# Altium schematic sheet 04_GAP_GPIO.SchDoc: SENSEI Base Board - GAP GPIO
size A3; DrawnBy: Sebastian Frey; Organization: Integrated Systems Laboratory; DocumentNumber: 5; Revision: v1.0; SheetNumber: 5; SheetTotal: 12
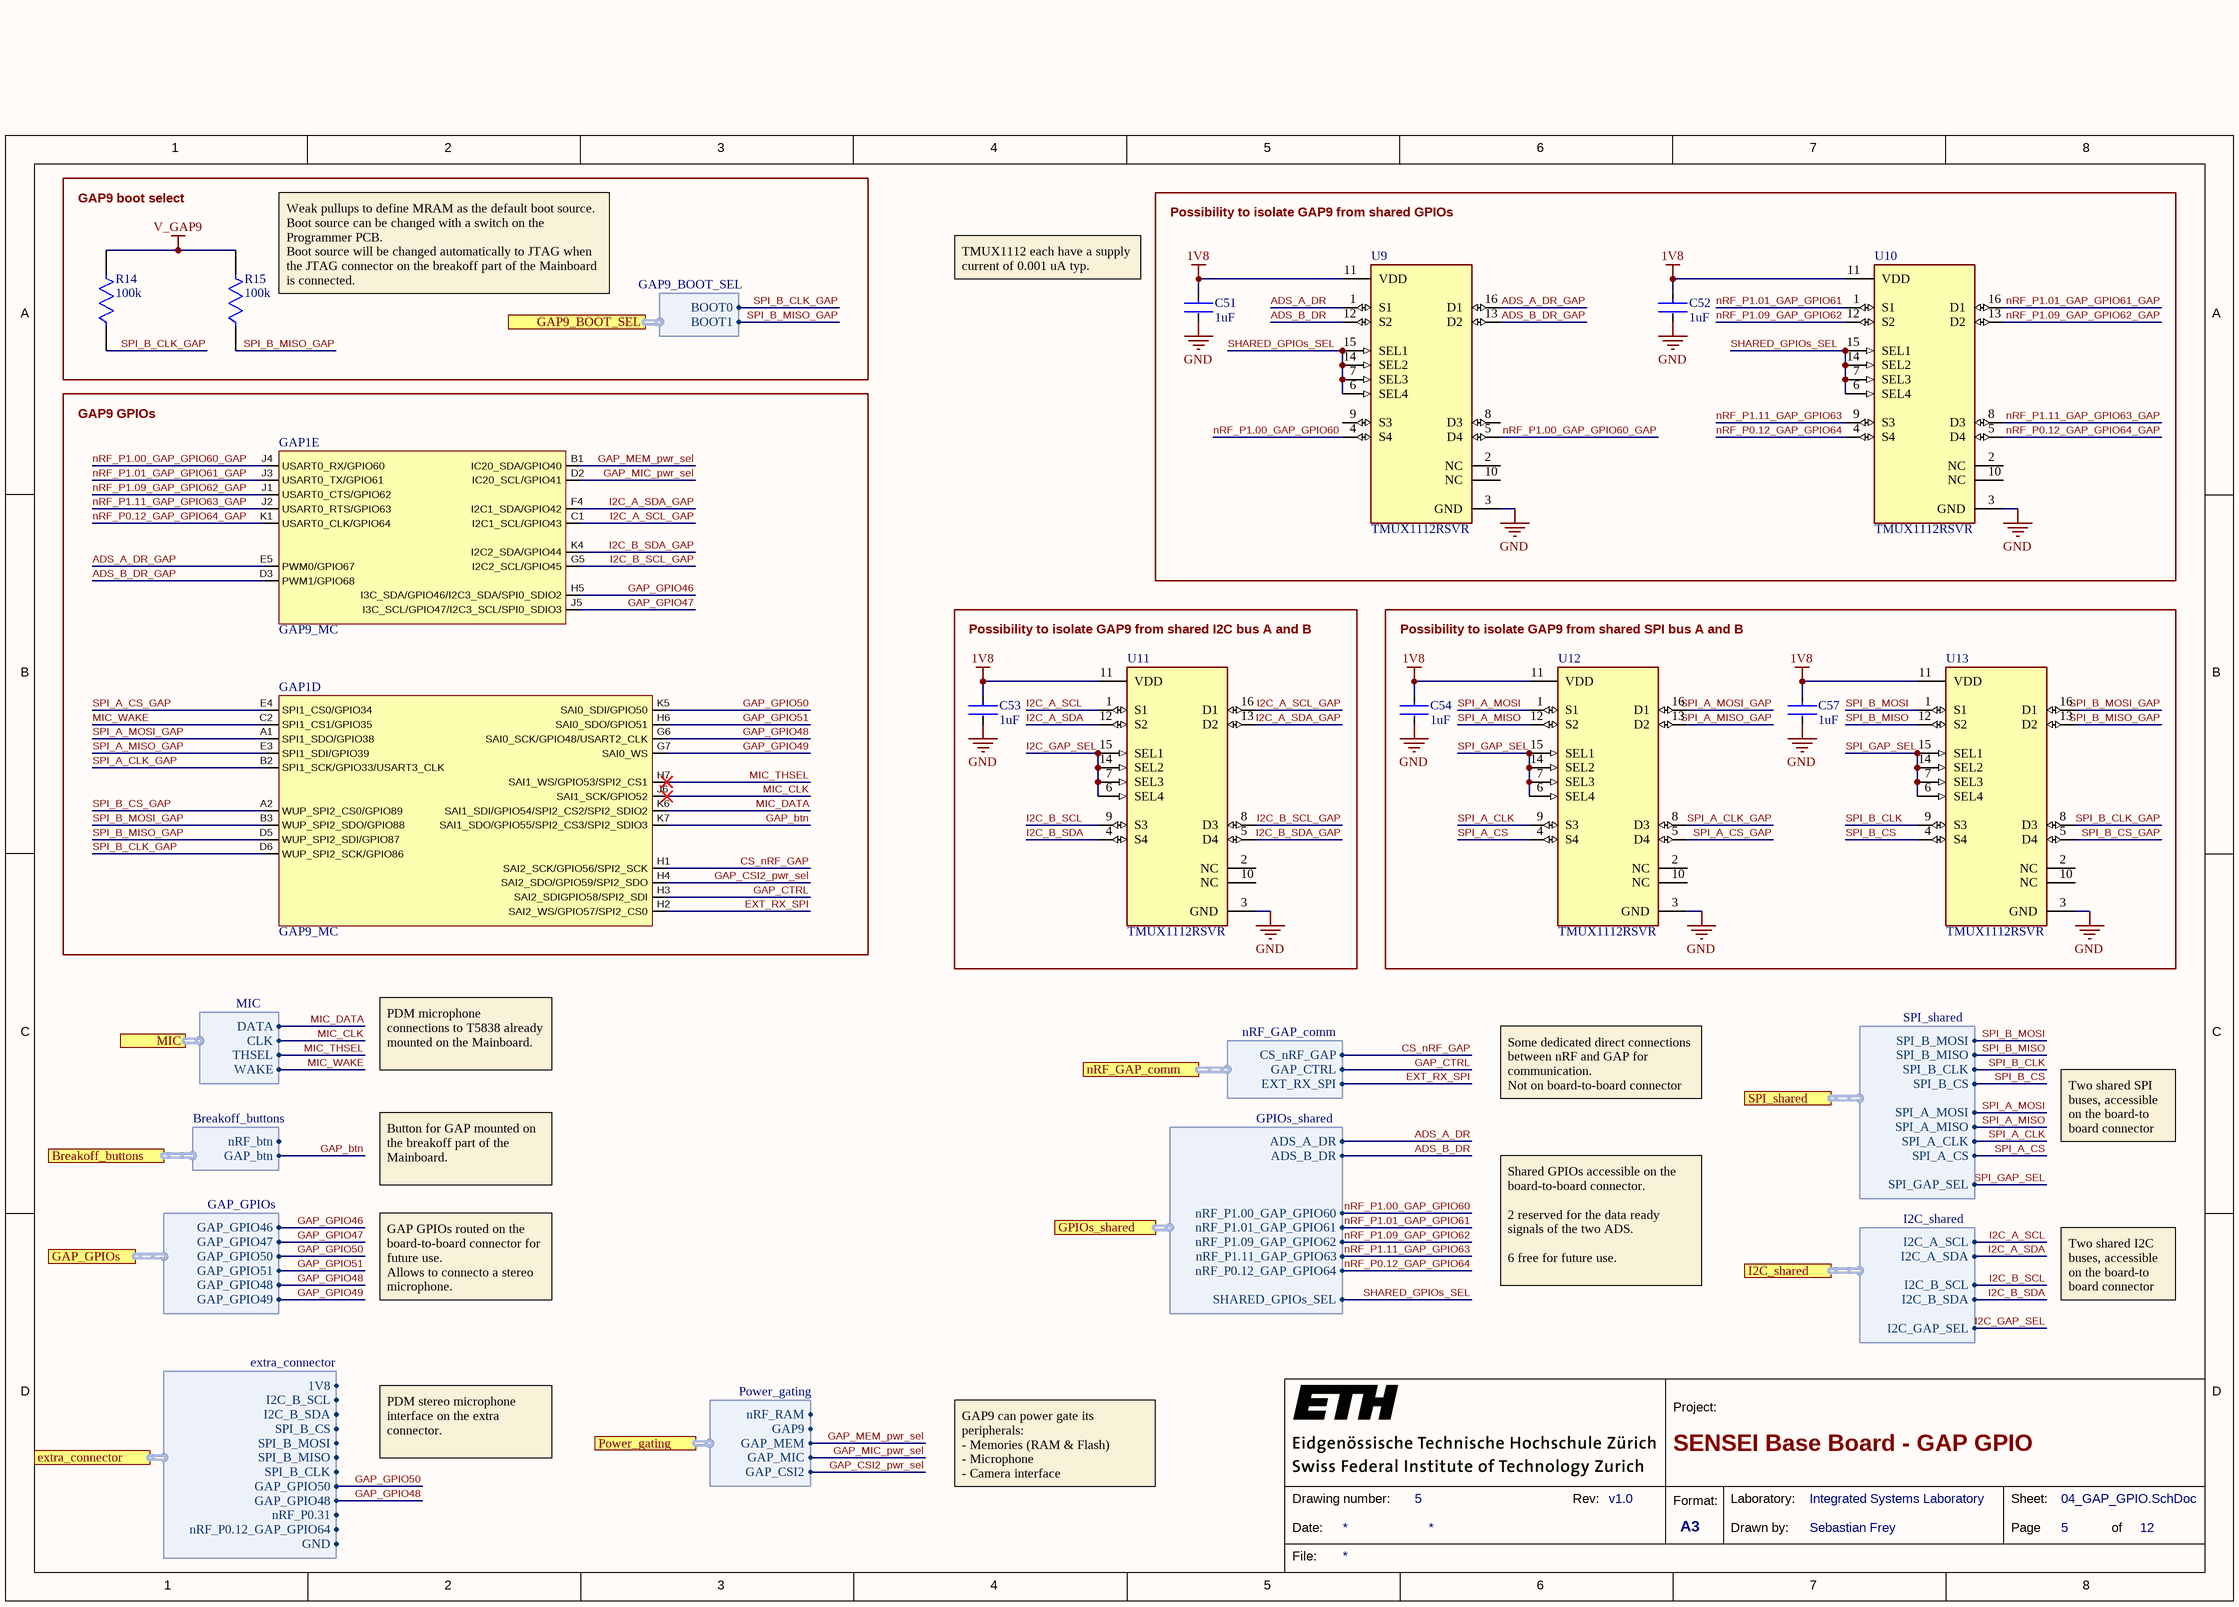
[diagram p0: 04_GAP_GPIO.SchDoc]

## Parts
C51  Capacitance: 1uF  [FP-CL03-IPC_B]  (hidden comment: CL03A105KP3NSNC)
C52  Capacitance: 1uF  [FP-CL03-IPC_B]  (hidden comment: CL03A105KP3NSNC)
C53  Capacitance: 1uF  [FP-CL03-IPC_B]  (hidden comment: CL03A105KP3NSNC)
C54  Capacitance: 1uF  [FP-CL03-IPC_B]  (hidden comment: CL03A105KP3NSNC)
C57  Capacitance: 1uF  [FP-CL03-IPC_B]  (hidden comment: CL03A105KP3NSNC)
GAP1  GAP9_MC  [GAP9]  (parts D,E of 5)
R14  Resistance: 100k  [FP-RR0510-IPC_C]  (hidden comment: RR0510P-104-D)
R15  Resistance: 100k  [FP-RR0510-IPC_C]  (hidden comment: RR0510P-104-D)
U9  TMUX1112RSVR  [FP-RSV0016A-MFG]
U10  TMUX1112RSVR  [FP-RSV0016A-MFG]
U11  TMUX1112RSVR  [FP-RSV0016A-MFG]
U12  TMUX1112RSVR  [FP-RSV0016A-MFG]
U13  TMUX1112RSVR  [FP-RSV0016A-MFG]

## Blocks framed on the sheet
GAP9 boot select: R14 R15
Possibility to isolate GAP9 from shared GPIOs: C51 C52 U9 U10
GAP9 GPIOs: GAP1
Possibility to isolate GAP9 from shared I2C bus A and B: C53 U11
Possibility to isolate GAP9 from shared SPI bus A and B: C54 C57 U12 U13

## Ports
Breakoff_buttons (harness Breakoff_buttons), extra_connector (harness extra_connector), GAP9_BOOT_SEL (harness GAP9_BOOT_SEL), GAP_GPIOs (harness GAP_GPIOs), GPIOs_shared (harness GPIOs_shared), I2C_shared (harness I2C_shared), MIC (harness MIC), nRF_GAP_comm (harness nRF_GAP_comm), Power_gating (harness Power_gating), SPI_shared (harness SPI_shared)

## Harnesses
SPI_shared: SPI_B_MOSI, SPI_B_MISO, SPI_B_CLK, SPI_B_CS, SPI_A_MOSI, SPI_A_MISO, SPI_A_CLK, SPI_A_CS, SPI_GAP_SEL
I2C_shared: I2C_A_SCL, I2C_A_SDA, I2C_B_SCL, I2C_B_SDA, I2C_GAP_SEL
GPIOs_shared: ADS_A_DR, ADS_B_DR, nRF_P1.00_GAP_GPIO60, nRF_P1.09_GAP_GPIO62, nRF_P1.11_GAP_GPIO63, nRF_P0.12_GAP_GPIO64, SHARED_GPIOs_SEL, nRF_P1.01_GAP_GPIO61
nRF_GAP_comm: CS_nRF_GAP, GAP_CTRL, EXT_RX_SPI
MIC: DATA, THSEL, WAKE, CLK
GAP_GPIOs: GAP_GPIO46, GAP_GPIO47, GAP_GPIO50, GAP_GPIO51, GAP_GPIO48, GAP_GPIO49
extra_connector: SPI_B_CS, SPI_B_MOSI, SPI_B_MISO, SPI_B_CLK, GAP_GPIO50, GAP_GPIO48, I2C_B_SDA, nRF_P0.12_GAP_GPIO64, GND, I2C_B_SCL, 1V8, nRF_P0.31
Power_gating: nRF_RAM, GAP9, GAP_MEM, GAP_MIC, GAP_CSI2
GAP9_BOOT_SEL: BOOT0, BOOT1
Breakoff_buttons: nRF_btn, GAP_btn

## Nets
1V8: C51.1 C52.1 C53.1 C54.1 C57.1 U9.11(VDD) U10.11(VDD) U11.11(VDD) U12.11(VDD) U13.11(VDD)
GND: C51.2 C52.2 C53.2 C54.2 C57.2 U9.3(GND) U10.3(GND) U11.3(GND) U12.3(GND) U13.3(GND)
V_GAP9: R14.2 R15.2
ADS_A_DR: U9.1(S1) ; port GPIOs_shared.ADS_A_DR
ADS_A_DR_GAP: GAP1.E5(PWM0/GPIO67) U9.16(D1)
ADS_B_DR: U9.12(S2) ; port GPIOs_shared.ADS_B_DR
ADS_B_DR_GAP: GAP1.D3(PWM1/GPIO68) U9.13(D2)
CS_nRF_GAP: GAP1.H1(SAI2_SCK/GPIO56/SPI2_SCK) ; port nRF_GAP_comm.CS_nRF_GAP
EXT_RX_SPI: GAP1.H2(SAI2_WS/GPIO57/SPI2_CS0) ; port nRF_GAP_comm.EXT_RX_SPI
GAP_btn: GAP1.K7(SAI1_SDO/GPIO55/SPI2_CS3/SPI2_SDIO3) ; port Breakoff_buttons.GAP_btn
GAP_CSI2_pwr_sel: GAP1.H4(SAI2_SDO/GPIO59/SPI2_SDO) ; port Power_gating.GAP_CSI2
GAP_CTRL: GAP1.H3(SAI2_SDIGPIO58/SPI2_SDI) ; port nRF_GAP_comm.GAP_CTRL
GAP_GPIO46: GAP1.H5(I3C_SDA/GPIO46/I2C3_SDA/SPI0_SDIO2) ; port GAP_GPIOs.GAP_GPIO46
GAP_GPIO47: GAP1.J5(I3C_SCL/GPIO47/I2C3_SCL/SPI0_SDIO3) ; port GAP_GPIOs.GAP_GPIO47
GAP_GPIO48: GAP1.G6(SAI0_SCK/GPIO48/USART2_CLK) ; port GAP_GPIOs.GAP_GPIO48, port extra_connector.GAP_GPIO48
GAP_GPIO49: GAP1.G7(SAI0_WS) ; port GAP_GPIOs.GAP_GPIO49
GAP_GPIO50: GAP1.K5(SAI0_SDI/GPIO50) ; port GAP_GPIOs.GAP_GPIO50, port extra_connector.GAP_GPIO50
GAP_GPIO51: GAP1.H6(SAI0_SDO/GPIO51) ; port GAP_GPIOs.GAP_GPIO51
GAP_MEM_pwr_sel: GAP1.B1(IC20_SDA/GPIO40) ; port Power_gating.GAP_MEM
GAP_MIC_pwr_sel: GAP1.D2(IC20_SCL/GPIO41) ; port Power_gating.GAP_MIC
I2C_A_SCL: U11.1(S1) ; port I2C_shared.I2C_A_SCL
I2C_A_SCL_GAP: GAP1.C1(I2C1_SCL/GPIO43) U11.16(D1)
I2C_A_SDA: U11.12(S2) ; port I2C_shared.I2C_A_SDA
I2C_A_SDA_GAP: GAP1.F4(I2C1_SDA/GPIO42) U11.13(D2)
I2C_B_SCL: U11.9(S3) ; port I2C_shared.I2C_B_SCL
I2C_B_SCL_GAP: GAP1.G5(I2C2_SCL/GPIO45) U11.8(D3)
I2C_B_SDA: U11.4(S4) ; port I2C_shared.I2C_B_SDA
I2C_B_SDA_GAP: GAP1.K4(I2C2_SDA/GPIO44) U11.5(D4)
I2C_GAP_SEL: U11.6(SEL4) U11.7(SEL3) U11.14(SEL2) U11.15(SEL1) ; port I2C_shared.I2C_GAP_SEL
MIC_CLK: GAP1.J6(SAI1_SCK/GPIO52) ; port MIC.CLK
MIC_DATA: GAP1.K6(SAI1_SDI/GPIO54/SPI2_CS2/SPI2_SDIO2) ; port MIC.DATA
MIC_THSEL: GAP1.H7(SAI1_WS/GPIO53/SPI2_CS1) ; port MIC.THSEL
MIC_WAKE: GAP1.C2(SPI1_CS1/GPIO35) ; port MIC.WAKE
nRF_P0.12_GAP_GPIO64: U10.4(S4) ; port GPIOs_shared.nRF_P0.12_GAP_GPIO64
nRF_P0.12_GAP_GPIO64_GAP: GAP1.K1(USART0_CLK/GPIO64) U10.5(D4)
nRF_P1.00_GAP_GPIO60: U9.4(S4) ; port GPIOs_shared.nRF_P1.00_GAP_GPIO60
nRF_P1.00_GAP_GPIO60_GAP: GAP1.J4(USART0_RX/GPIO60) U9.5(D4)
nRF_P1.01_GAP_GPIO61: U10.1(S1) ; port GPIOs_shared.nRF_P1.01_GAP_GPIO61
nRF_P1.01_GAP_GPIO61_GAP: GAP1.J3(USART0_TX/GPIO61) U10.16(D1)
nRF_P1.09_GAP_GPIO62: U10.12(S2) ; port GPIOs_shared.nRF_P1.09_GAP_GPIO62
nRF_P1.09_GAP_GPIO62_GAP: GAP1.J1(USART0_CTS/GPIO62) U10.13(D2)
nRF_P1.11_GAP_GPIO63: U10.9(S3) ; port GPIOs_shared.nRF_P1.11_GAP_GPIO63
nRF_P1.11_GAP_GPIO63_GAP: GAP1.J2(USART0_RTS/GPIO63) U10.8(D3)
SHARED_GPIOs_SEL: U9.6(SEL4) U9.7(SEL3) U9.14(SEL2) U9.15(SEL1) U10.6(SEL4) U10.7(SEL3) U10.14(SEL2) U10.15(SEL1) ; port GPIOs_shared.SHARED_GPIOs_SEL
SPI_A_CLK: U12.9(S3) ; port SPI_shared.SPI_A_CLK
SPI_A_CLK_GAP: GAP1.B2(SPI1_SCK/GPIO33/USART3_CLK) U12.8(D3)
SPI_A_CS: U12.4(S4) ; port SPI_shared.SPI_A_CS
SPI_A_CS_GAP: GAP1.E4(SPI1_CS0/GPIO34) U12.5(D4)
SPI_A_MISO: U12.12(S2) ; port SPI_shared.SPI_A_MISO
SPI_A_MISO_GAP: GAP1.E3(SPI1_SDI/GPIO39) U12.13(D2)
SPI_A_MOSI: U12.1(S1) ; port SPI_shared.SPI_A_MOSI
SPI_A_MOSI_GAP: GAP1.A1(SPI1_SDO/GPIO38) U12.16(D1)
SPI_B_CLK: U13.9(S3) ; port SPI_shared.SPI_B_CLK
SPI_B_CLK_GAP: GAP1.D6(WUP_SPI2_SCK/GPIO86) R14.1 U13.8(D3) ; port GAP9_BOOT_SEL.BOOT0
SPI_B_CS: U13.4(S4) ; port SPI_shared.SPI_B_CS
SPI_B_CS_GAP: GAP1.A2(WUP_SPI2_CS0/GPIO89) U13.5(D4)
SPI_B_MISO: U13.12(S2) ; port SPI_shared.SPI_B_MISO
SPI_B_MISO_GAP: GAP1.D5(WUP_SPI2_SDI/GPIO87) R15.1 U13.13(D2) ; port GAP9_BOOT_SEL.BOOT1
SPI_B_MOSI: U13.1(S1) ; port SPI_shared.SPI_B_MOSI
SPI_B_MOSI_GAP: GAP1.B3(WUP_SPI2_SDO/GPIO88) U13.16(D1)
SPI_GAP_SEL: U12.6(SEL4) U12.7(SEL3) U12.14(SEL2) U12.15(SEL1) U13.6(SEL4) U13.7(SEL3) U13.14(SEL2) U13.15(SEL1) ; port SPI_shared.SPI_GAP_SEL

Not connected (* = marked no-connect by the designer): U9 2(NC) 8(D3) 9(S3) 10(NC); U10 2(NC) 10(NC); U11 2(NC) 10(NC); U12 2(NC) 10(NC); U13 2(NC) 10(NC)

## Notes on the sheet
- (near R15) Weak pullups to define MRAM as the default boot source.
  Boot source can be changed with a switch on the Programmer PCB.
  Boot source will be changed automatically to JTAG when the JTAG connector on the breakoff part of the Mainboard is connected.
- TMUX1112 each have a supply current of 0.001 uA typ.
- PDM microphone connections to T5838 already mounted on the Mainboard.
- Some dedicated direct connections between nRF and GAP for communication.
  Not on board-to-board connector
- Button for GAP mounted on the breakoff part of the Mainboard.
- Two shared SPI buses, accessible on the board-to board connector
- GAP GPIOs routed on the board-to-board connector for future use.
  Allows to connecto a stereo microphone.
- Shared GPIOs accessible on the board-to-board connector.
  2 reserved for the data ready signals of the two ADS.
  6 free for future use.
- Two shared I2C buses, accessible on the board-to board connector
- PDM stereo microphone interface on the extra connector.
- GAP9 can power gate its peripherals:
  - Memories (RAM & Flash)
  - Microphone
  - Camera interface
- 1
- 2
- 3
- 4
- 5
- 6
- 7
- 8
- A
- B
- C
- D
- Project:
- Date:
- Drawing number:
- Rev:
- Format:
- A3
- Drawn by:
- Laboratory:
- Page
- Sheet:
- of
- File:

## Library data of the parts
C51-C54 C57 = CMP-13271-003594-1: Cap Ceramic 1uF 10V X5R ±10% Pad SMD 0201 +85°C T/R; Min Operating Temperature: -55°C; Mount: Surface Mount; Packaging: Cut Tape; Width: 0.012inch; Tolerance: 10%; Case Code (Imperial): 0201; Thickness: 0.013inch; Length: 0.024inch; Case/Package: 0201; Max Operating Temperature: 85°C; Voltage Rating: 10V; Case Code (Metric): 0603
R14 R15 = CMP-2002-01533-2: 100kΩ ±0.5% 0.0625W 1/16W Chip Resistor 0402 (1005 Metric) Thin Film; Power Rating: 63mW; Working Voltage: 25V; Temperature Coefficient: 25ppm/°C; Series: RR; Max Operating Temperature: 125°C; RoHS Compliant: Yes; Number of Pins: 2; Width: 0.02inch; Case Code (Imperial): 0402; Voltage Rating (DC): 25V; Length: 0.039inch; Case/Package: 0402; Tolerance: 0.5%; Lead Free: Lead Free; Technology: THIN FILM; Termination: SMD/SMT; Case Code (Metric): 1005; Resistance Tolerance: 0.5%; Resistor Type: Thin Film; Min Operating Temperature: -55°C; Package Quantity: 1; Packaging: Tape and Reel; Height: 0.016inch; REACH SVHC: No SVHC; Number of Terminations: 2; Voltage Rating: 25V; Max Power Dissipation: 63mW
U9-U13 = CMP-04892-000017-1: IC SWITCH; Manufacturer: Texas Instruments; Mux Demux Ratio: 1:1; Throw Configuration: SPST; Max Supply Voltage: 5.5V; Interface: LVCMOS; Nominal Supply Current: 0.008uA; Number Of Circuits: 4; -3Db Bandwith: 300MHz; On State Resistance: 2Ω; Max Junction Temp: +150°C; Min Supply Voltage: 1.08V; Standoff Height: 0mm; ComponentLink2Description: Datasheet; Ambient Temperature Range High: +125°C; ComponentLink2URL: http://www.ti.com/lit/ds/symlink/tmux1111.pdf; Device Class L1: Integrated Circuits (ICs); Device Class L3: Analog Switches; Device Class L2: Interface ICs; Lead Free: Yes; RoHS: TRUE; Temperature: -40°C to +125°C; Temperature Range Low: -40°C; Digikey Description: IC SWITCH; Category: IC; Package: RSV0016A; Octopart: https://octopart.com/tmux1112rsvr-texas+instruments-99389231; Ambient Temperature Range Low: -40°C; Height: 0.55mm; Temperature Range High: +125°C; Manufacturer Part Number: TMUX1112RSVR; Automotive: No